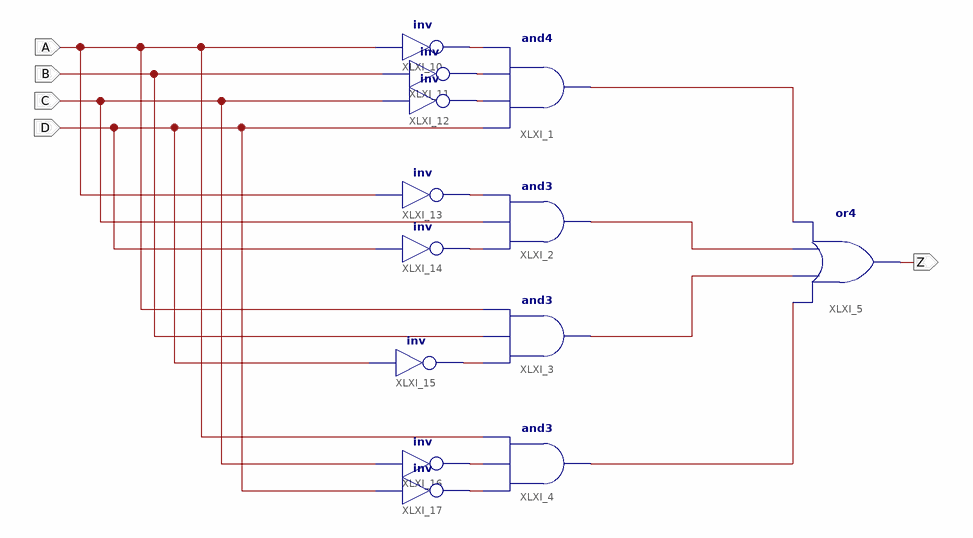
[diagram p0: schematic sheet 1]
// Xilinx ISE schematic p1ej1.sch (spartan3) as structural Verilog: 13 symbols, 5 ports
module p1ej1 (
  input  A,
  input  B,
  input  C,
  input  D,
  output Z
);

  wire XLXN_1, XLXN_2, XLXN_3, XLXN_4, XLXN_25, XLXN_26, XLXN_27, XLXN_28, XLXN_29, XLXN_30, XLXN_31, XLXN_51;

  and XLXI_1 (XLXN_1, D, XLXN_27, XLXN_26, XLXN_25);
  and XLXI_2 (XLXN_2, XLXN_29, C, XLXN_28);
  and XLXI_3 (XLXN_3, XLXN_30, B, A);
  and XLXI_4 (XLXN_4, XLXN_51, XLXN_31, A);
  or XLXI_5 (Z, XLXN_4, XLXN_3, XLXN_2, XLXN_1);
  not XLXI_10 (XLXN_25, A);
  not XLXI_11 (XLXN_26, B);
  not XLXI_12 (XLXN_27, C);
  not XLXI_13 (XLXN_28, A);
  not XLXI_14 (XLXN_29, D);
  not XLXI_15 (XLXN_30, D);
  not XLXI_16 (XLXN_31, C);
  not XLXI_17 (XLXN_51, D);
endmodule
